# Altium schematic sheet BIO_SENSOR.SchDoc
size A3; SheetNumber: 7; SheetTotal: 12
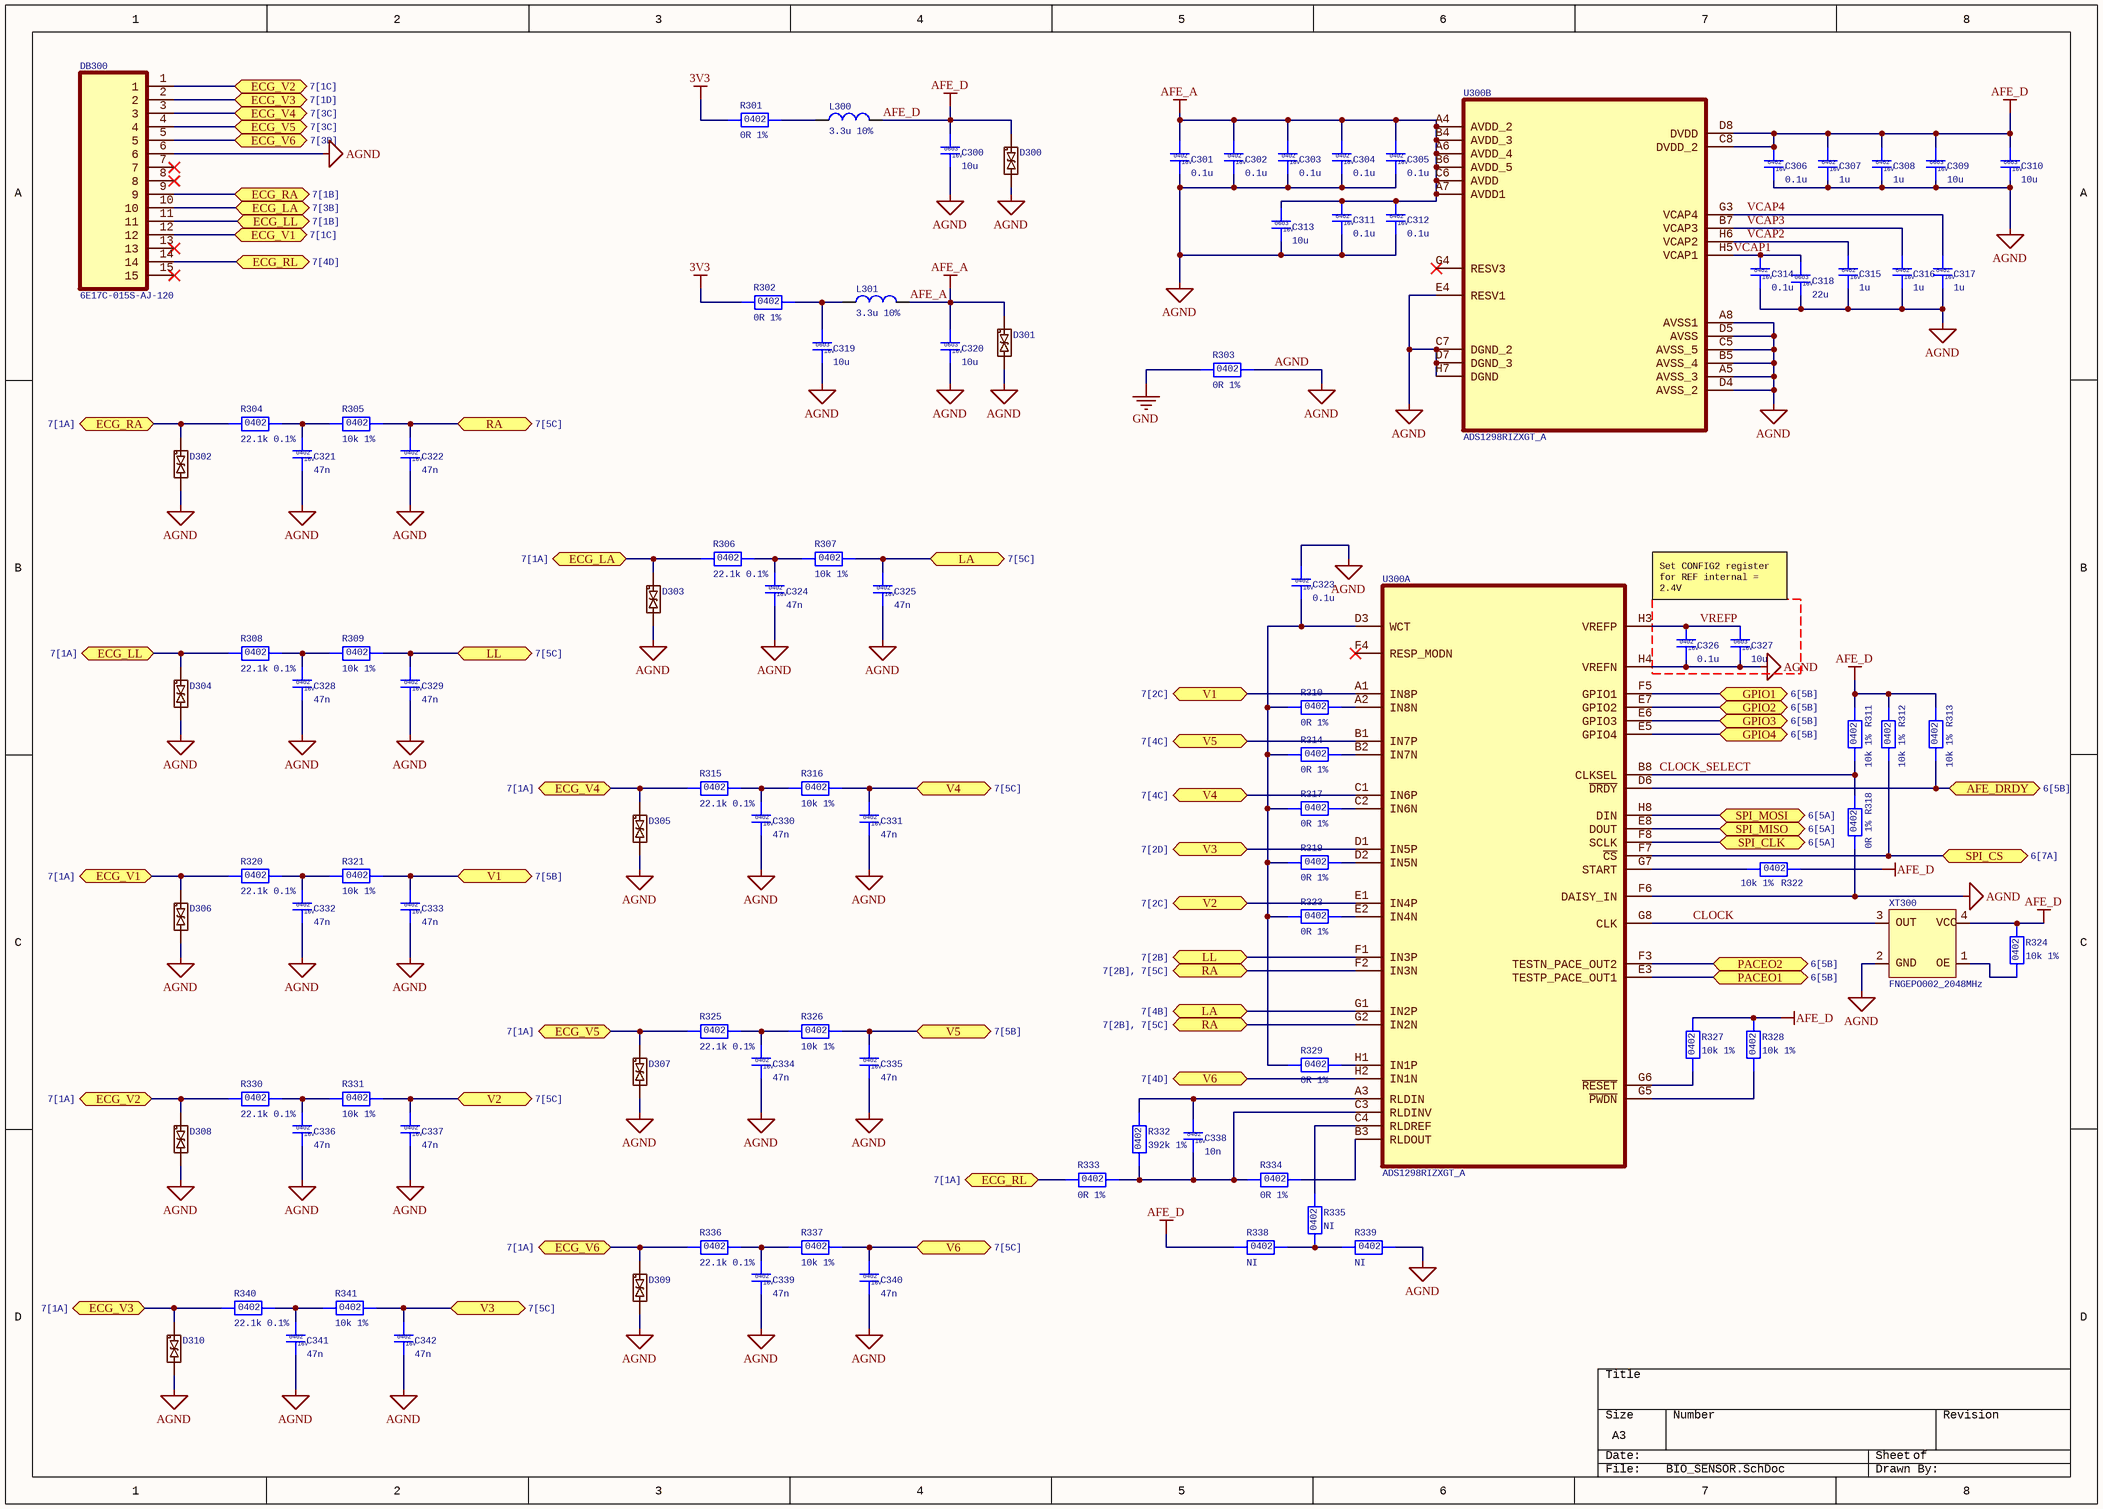
[diagram p0: BIO_SENSOR.SchDoc]

## Parts
C300  10u  [CAP0603]
C301  0.1u  [CAP0402]
C302  0.1u  [CAP0402]
C303  0.1u  [CAP0402]
C304  0.1u  [CAP0402]
C305  0.1u  [CAP0402]
C306  0.1u  [CAP0402]
C307  1u  [CAP0402]
C308  1u  [CAP0402]
C309  10u  [CAP0603]
C310  10u  [CAP0603]
C311  0.1u  [CAP0402]
C312  0.1u  [CAP0402]
C313  10u  [CAP0603]
C314  0.1u  [CAP0402]
C315  1u  [CAP0402]
C316  1u  [CAP0402]
C317  1u  [CAP0402]
C318  22u  [CAP0603]
C319  10u  [CAP0603]
C320  10u  [CAP0603]
C321  47n  [CAP0402]
C322  47n  [CAP0402]
C323  0.1u  [CAP0402]
C324  47n  [CAP0402]
C325  47n  [CAP0402]
C326  0.1u  [CAP0402]
C327  10u  [CAP0603]
C328  47n  [CAP0402]
C329  47n  [CAP0402]
C330  47n  [CAP0402]
C331  47n  [CAP0402]
C332  47n  [CAP0402]
C333  47n  [CAP0402]
C334  47n  [CAP0402]
C335  47n  [CAP0402]
C336  47n  [CAP0402]
C337  47n  [CAP0402]
C338  10n  [CAP0402]
C339  47n  [CAP0402]
C340  47n  [CAP0402]
C341  47n  [CAP0402]
C342  47n  [CAP0402]
D300  DESD3V3S1BL-7B  [DESD3V3S1BL-7B]  (value not drawn)
D301  DESD3V3S1BL-7B  [DESD3V3S1BL-7B]  (value not drawn)
D302  DESD3V3S1BL-7B  [DESD3V3S1BL-7B]  (value not drawn)
D303  DESD3V3S1BL-7B  [DESD3V3S1BL-7B]  (value not drawn)
D304  DESD3V3S1BL-7B  [DESD3V3S1BL-7B]  (value not drawn)
D305  DESD3V3S1BL-7B  [DESD3V3S1BL-7B]  (value not drawn)
D306  DESD3V3S1BL-7B  [DESD3V3S1BL-7B]  (value not drawn)
D307  DESD3V3S1BL-7B  [DESD3V3S1BL-7B]  (value not drawn)
D308  DESD3V3S1BL-7B  [DESD3V3S1BL-7B]  (value not drawn)
D309  DESD3V3S1BL-7B  [DESD3V3S1BL-7B]  (value not drawn)
D310  DESD3V3S1BL-7B  [DESD3V3S1BL-7B]  (value not drawn)
DB300  6E17C-015S-AJ-120  [6E17C-015S-AJ-120]
L300  3.3u 10%  [0402(1005)]
L301  3.3u 10%  [0402(1005)]
R301  0R 1%  [RES0402]
R302  0R 1%  [RES0402]
R303  0R 1%  [RES0402]
R304  22.1k 0.1%  [R0402]
R305  10k 1%  [R0402]
R306  22.1k 0.1%  [R0402]
R307  10k 1%  [R0402]
R308  22.1k 0.1%  [R0402]
R309  10k 1%  [R0402]
R310  0R 1%  [RES0402]
R311  10k 1%  [R0402]
R312  10k 1%  [R0402]
R313  10k 1%  [R0402]
R314  0R 1%  [RES0402]
R315  22.1k 0.1%  [R0402]
R316  10k 1%  [R0402]
R317  0R 1%  [RES0402]
R318  0R 1%  [RES0402]
R319  0R 1%  [RES0402]
R320  22.1k 0.1%  [R0402]
R321  10k 1%  [R0402]
R322  10k 1%  [R0402]
R323  0R 1%  [RES0402]
R324  10k 1%  [R0402]
R325  22.1k 0.1%  [R0402]
R326  10k 1%  [R0402]
R327  10k 1%  [R0402]
R328  10k 1%  [R0402]
R329  0R 1%  [RES0402]
R330  22.1k 0.1%  [R0402]
R331  10k 1%  [R0402]
R332  392k 1%  [R0402]
R333  0R 1%  [RES0402]
R334  0R 1%  [RES0402]
R335  NI  [RES0402]
R336  22.1k 0.1%  [R0402]
R337  10k 1%  [R0402]
R338  NI  [RES0402]
R339  NI  [RES0402]
R340  22.1k 0.1%  [R0402]
R341  10k 1%  [R0402]
U300  ADS1298RIZXGT_A  [ADS1298RIZXGT]  (parts A,B of 2)
XT300  FNGEPO002_2048MHz  [FNGEPO002]

## Ports
AFE_DRDY (bidir, see 6[5B]), ECG_LA (bidir, see 7[1A]), ECG_LA (bidir, see 7[3B]), ECG_LL (bidir, see 7[1A]), ECG_LL (bidir, see 7[1B]), ECG_RA (bidir, see 7[1A]), ECG_RA (bidir, see 7[1B]), ECG_RL (bidir, see 7[1A]), ECG_RL (bidir, see 7[4D]), ECG_V1 (bidir, see 7[1A]), ECG_V1 (bidir, see 7[1C]), ECG_V2 (bidir, see 7[1A]), ECG_V2 (bidir, see 7[1C]), ECG_V3 (bidir, see 7[1A]), ECG_V3 (bidir, see 7[1D]), ECG_V4 (bidir, see 7[1A]), ECG_V4 (bidir, see 7[3C]), ECG_V5 (bidir, see 7[1A]), ECG_V5 (bidir, see 7[3C]), ECG_V6 (bidir, see 7[1A]), ECG_V6 (bidir, see 7[3D]), GPIO1 (bidir, see 6[5B]), GPIO2 (bidir, see 6[5B]), GPIO3 (bidir, see 6[5B]), GPIO4 (bidir, see 6[5B]), LA (bidir, see 7[4B]), LA (bidir, see 7[5C]), LL (bidir, see 7[2B]), LL (bidir, see 7[5C]), PACEO1 (bidir, see 6[5B]), PACEO2 (bidir, see 6[5B]), RA (bidir, see 7[2B], 7[5C]), RA (bidir, see 7[5C]), SPI_CLK (bidir, see 6[5A]), SPI_CS (bidir, see 6[7A]), SPI_MISO (bidir, see 6[5A]), SPI_MOSI (bidir, see 6[5A]), V1 (bidir, see 7[2C]), V1 (bidir, see 7[5B]), V2 (bidir, see 7[2C]), V2 (bidir, see 7[5C]), V3 (bidir, see 7[2D]), V3 (bidir, see 7[5C]), V4 (bidir, see 7[4C]), V4 (bidir, see 7[5C]), V5 (bidir, see 7[4C]), V5 (bidir, see 7[5B]), V6 (bidir, see 7[4D]), V6 (bidir, see 7[5C])

## Nets
3V3: R301.1 R302.1
AFE_A: C301.1 C302.1 C303.1 C304.1 C305.1 C311.1 C312.1 C313.1 C320.1 D301.1 L301.2 U300.A4(AVDD_2) U300.A6(AVDD_4) U300.A7(AVDD1) U300.B4(AVDD_3) U300.B6(AVDD_5) U300.C6(AVDD)
AFE_D: C300.1 C306.1 C307.1 C308.1 C309.1 C310.1 D300.1 L300.2 R311.2 R312.2 R313.2 R322.2 R324.2 R327.2 R328.2 R338.1 U300.C8(DVDD_2) U300.D8(DVDD) XT300.4(VCC)
AGND: C300.2 C301.2 C302.2 C303.2 C304.2 C305.2 C306.2 C307.2 C308.2 C309.2 C310.2 C311.2 C312.2 C313.2 C314.2 C315.2 C316.2 C317.2 C318.2 C319.2 C320.2 C321.2 C322.2 C323.1 C324.2 C325.2 C326.2 C327.2 C328.2 C329.2 C330.2 C331.2 C332.2 C333.2 C334.2 C335.2 C336.2 C337.2 C339.2 C340.2 C341.2 C342.2 D300.2 D301.2 D302.2 D303.2 D304.2 D305.2 D306.2 D307.2 D308.2 D309.2 D310.2 DB300.6 R303.2 R318.1 R339.2 U300.A5(AVSS_3) U300.A8(AVSS1) U300.B5(AVSS_4) U300.C5(AVSS_5) U300.C7(DGND_2) U300.D4(AVSS_2) U300.D5(AVSS) U300.D7(DGND_3) U300.E4(RESV1) U300.F6(DAISY_IN) U300.H4(VREFN) U300.H7(DGND) XT300.2
GND: R303.1
AFE_DRDY: R313.1 U300.D6(~{DRDY}) ; port AFE_DRDY
CLOCK: U300.G8(CLK) XT300.3(OUT)
CLOCK_SELECT: R311.1 R318.2 U300.B8(CLKSEL)
ECG_LA: D303.1 DB300.10 R306.1 ; port ECG_LA
ECG_LL: D304.1 DB300.11 R308.1 ; port ECG_LL
ECG_RA: D302.1 DB300.9 R304.1 ; port ECG_RA
ECG_RL: DB300.14 R333.1 ; port ECG_RL
ECG_V1: D306.1 DB300.12 R320.1 ; port ECG_V1
ECG_V2: D308.1 DB300.1 R330.1 ; port ECG_V2
ECG_V3: D310.1 DB300.2 R340.1 ; port ECG_V3
ECG_V4: D305.1 DB300.3 R315.1 ; port ECG_V4
ECG_V5: D307.1 DB300.4 R325.1 ; port ECG_V5
ECG_V6: D309.1 DB300.5 R336.1 ; port ECG_V6
GPIO1: U300.F5(GPIO1) ; port GPIO1
GPIO2: U300.E7(GPIO2) ; port GPIO2
GPIO3: U300.E6(GPIO3) ; port GPIO3
GPIO4: U300.E5(GPIO4) ; port GPIO4
LA: C325.1 R307.2 U300.G1(IN2P) ; port LA
LL: C329.1 R309.2 U300.F1(IN3P) ; port LL
PACEO1: U300.E3(TESTP_PACE_OUT1) ; port PACEO1
PACEO2: U300.F3(TESTN_PACE_OUT2) ; port PACEO2
RA: C322.1 R305.2 U300.F2(IN3N) U300.G2(IN2N) ; port RA
SPI_CLK: U300.F8(SCLK) ; port SPI_CLK
SPI_CS: R312.1 U300.F7(~{CS}) ; port SPI_CS
SPI_MISO: U300.E8(DOUT) ; port SPI_MISO
SPI_MOSI: U300.H8(DIN) ; port SPI_MOSI
V1: C333.1 R321.2 U300.A1(IN8P) ; port V1
V2: C337.1 R331.2 U300.E1(IN4P) ; port V2
V3: C342.1 R341.2 U300.D1(IN5P) ; port V3
V4: C331.1 R316.2 U300.C1(IN6P) ; port V4
V5: C335.1 R326.2 U300.B1(IN7P) ; port V5
V6: C340.1 R337.2 U300.H2(IN1N) ; port V6
VCAP1: C314.1 C318.1 U300.H5(VCAP1)
VCAP2: C315.1 U300.H6(VCAP2)
VCAP3: C316.1 U300.B7(VCAP3)
VCAP4: C317.1 U300.G3(VCAP4)
VREFP: C326.1 C327.1 U300.H3(VREFP)
NetC319_1: C319.1 L301.1 R302.2
NetC321_1: C321.1 R304.2 R305.1
NetC323_2: C323.2 R310.1 R314.1 R317.1 R319.1 R323.1 R329.1 U300.D3(WCT)
NetC324_1: C324.1 R306.2 R307.1
NetC328_1: C328.1 R308.2 R309.1
NetC330_1: C330.1 R315.2 R316.1
NetC332_1: C332.1 R320.2 R321.1
NetC334_1: C334.1 R325.2 R326.1
NetC336_1: C336.1 R330.2 R331.1
NetC338_1: C338.1 R332.2 U300.A3(RLDIN)
NetC338_2: C338.2 R332.1 R333.2 R334.1 U300.C3(RLDINV)
NetC339_1: C339.1 R336.2 R337.1
NetC341_1: C341.1 R340.2 R341.1
NetL300_1: L300.1 R301.2
NetR310_2: R310.2 U300.A2(IN8N)
NetR314_2: R314.2 U300.B2(IN7N)
NetR317_2: R317.2 U300.C2(IN6N)
NetR319_2: R319.2 U300.D2(IN5N)
NetR322_1: R322.1 U300.G7(START)
NetR323_2: R323.2 U300.E2(IN4N)
NetR324_1: R324.1 XT300.1
NetR327_1: R327.1 U300.G6(~{RESET})
NetR328_1: R328.1 U300.G5(~{PWDN})
NetR329_2: R329.2 U300.H1(IN1P)
NetR334_2: R334.2 U300.B3(RLDOUT)
NetR335_1: R335.1 R338.2 R339.1
NetR335_2: R335.2 U300.C4(RLDREF)

Not connected (* = marked no-connect by the designer): DB300 7* 8* 13* 15*; U300 F4(RESP_MODN)* G4(RESV3)*

## Notes on the sheet
- Set CONFIG2 register for REF internal = 2.4V
- (in symbol FNGEPO002_2048MHz) GND; OE

## Library data of the parts
C300 C309 C310 C313 C319 C320 C327 = C_0402_10u: Ceramic Capacitor, Multilayer, Ceramic, 16V, 20% +Tol, 20% -Tol, X5R, 15% TC, 10uF, Surface Mount, 0603; Manufacturer: Murata; Manufacturer Part Number: GRT188R61C106ME13D; Multilayer: Yes; Reference Standard: AEC-Q200; Supplier: Digikey; Supplier Part Number: 490-12318-1-ND; RoHS: Yes; Category: Ceramic Capacitors; Stock: 232325; Pricing: 1=0.24, 10=0.158, 50=0.1162, 100=0.0947, 500=0.07476, 1000=0.06313 (USD); Mounting Technology: Surface Mount; Pins: 2; Dielectric Material: Ceramic; Package Shape: Rectangular; Case/Package: 0603; Terminal Finish: Nickel; Min Operating Temperature: -55°C; Max Operating Temperature: 85°C; JESD-609 Code: e3; Value: 10uF; Capacitor Type: Ceramic; Tolerance  (fill in as +-): 20%; Packaging: Tape and Reel; Tolerance (fill in as +-): 20%; Rated DC Voltage (URdc): 16V; Temperature Characteristics Code: X5R; Termination: Wraparound; Reach SVHC Compliant: Yes; RoHS Compliant: Yes; ComponentLink1URL: https://datasheet.ciiva.com:443/pdfs/VipMasterIC/IC/MURE/MURE-S-A0004410517/MURE-S-A0004413840-1.pdf?src-supplier=IHS+Markit; ComponentLink1Description: https://datasheet.ciiva.com:443/pdfs/VipMasterIC/IC/MURE/MURE-S-A0004410517/MURE-S-A0004413840-1.pdf?src-supplier=IHS+Markit; ComponentLink2URL: http://search.murata.co.jp/Ceramy/image/img/A01X/G101/ENG/GRT188R61C106ME13-01.pdf?src-supplier=Digikey; ComponentLink2Description: http://search.murata.co.jp/Ceramy/image/img/A01X/G101/ENG/GRT188R61C106ME13-01.pdf?src-supplier=Digikey
C301-C306 C311 C312 C314 C323 C326 = C_0402_0.1u: Ceramic Capacitor, Multilayer, Ceramic, 16V, 10% +Tol, 10% -Tol, X7R, 15% TC, 0.1uF, Surface Mount, 0402; Manufacturer: Murata; Manufacturer Part Number: GRM155R71C104KA88J; Value: 100nF; Multilayer: Yes; Supplier: Digikey; Supplier Part Number: 490-6328-1-ND; RoHS: Yes; Category: Ceramic Capacitors; Stock: 19409569; Pricing: 1=0.1, 10=0.019, 50=0.011, 100=0.0086, 500=0.00646, 1000=0.00508, 2500=0.00462, 5000=0.00425 (USD); Mounting Technology: Surface Mount; Pins: 2; Dielectric Material: Ceramic; Package Shape: Rectangular; Case/Package: 0402; Terminal Finish: Nickel; Min Operating Temperature: -55°C; Max Operating Temperature: 125°C; JESD-609 Code: e3; Capacitor Type: Ceramic; Tolerance  (fill in as +-): 10%; Package Style: SMTMeter; Packaging: Tape and Reel; Tolerance (fill in as +-): 10%; Rated DC Voltage (URdc): 16V; Temperature Characteristics Code: X7R; Termination: Wraparound; Length: 1mm; Width: 0.5mm; Height: 0.5mm; Reach SVHC Compliant: Yes; RoHS Compliant: Yes; ComponentLink1URL: https://psearch.en.murata.com:443/capacitor/product/GRM155R71C104KA88%23.pdf?src-supplier=IHS+Markit; ComponentLink1Description: https://psearch.en.murata.com:443/capacitor/product/GRM155R71C104KA88%23.pdf?src-supplier=IHS+Markit; ComponentLink2URL: https://datasheet.ciiva.com/6271/product-6271168.pdf?src-supplier=Digikey; ComponentLink2Description: https://datasheet.ciiva.com/6271/product-6271168.pdf?src-supplier=Digikey; ComponentLink3URL: https://datasheet.ciiva.com/6271/grm155r71c104ka88-01-6271231.pdf?src-supplier=Digikey; ComponentLink3Description: https://datasheet.ciiva.com/6271/grm155r71c104ka88-01-6271231.pdf?src-supplier=Digikey
C307 C308 C315-C317 = C_0402_1u: Ceramic Capacitor, Multilayer, Ceramic, 16V, 10% +Tol, 10% -Tol, X5R, 15% TC, 1uF, Surface Mount, 0402; Manufacturer: Taiyo Yuden; Manufacturer Part Number: EMK105BJ105KV-F; Multilayer: Yes; Supplier: Digikey; Supplier Part Number: 587-2477-1-ND; RoHS: Yes; Category: Ceramic Capacitors; Stock: 2709915; Pricing: 1=0.1, 10=0.045, 50=0.031, 100=0.0266, 500=0.01912, 1000=0.01682, 2500=0.01437, 5000=0.01289 (USD); Mounting Technology: Surface Mount; Pins: 2; Dielectric Material: Ceramic; Package Shape: Rectangular; Case/Package: 0402; Terminal Finish: Nickel; Min Operating Temperature: -55°C; Max Operating Temperature: 85°C; JESD-609 Code: e3; Value: 1uF; Capacitor Type: Ceramic; Tolerance  (fill in as +-): 10%; Package Style: SMTMeter; Packaging: Tape and Reel; Tolerance (fill in as +-): 10%; Rated DC Voltage (URdc): 16V; Temperature Characteristics Code: X5R; Termination: Wraparound; Length: 1mm; Width: 0.5mm; Height: 0.5mm; Reach SVHC Compliant: Yes; RoHS Compliant: Yes; ComponentLink1URL: https://datasheet.ciiva.com:443/pdfs/VipMasterIC/IC/TAIY/TAIY-S-A0009096450/TAIY-S-A0009096597-1.pdf?src-supplier=IHS+Markit; ComponentLink1Description: https://datasheet.ciiva.com:443/pdfs/VipMasterIC/IC/TAIY/TAIY-S-A0009096450/TAIY-S-A0009096597-1.pdf?src-supplier=IHS+Markit; ComponentLink2URL: https://datasheet.ciiva.com/134/emk105bj105kv-f-ss-134209.pdf?src-supplier=Digikey; ComponentLink2Description: https://datasheet.ciiva.com/134/emk105bj105kv-f-ss-134209.pdf?src-supplier=Digikey; ComponentLink3URL: https://datasheet.ciiva.com/15920/964emk105bj105kv-f-15920402.pdf?src-supplier=Onlinecomponents.com; ComponentLink3Description: https://datasheet.ciiva.com/15920/964emk105bj105kv-f-15920402.pdf?src-supplier=Onlinecomponents.com; ComponentLink4URL: https://datasheet.ciiva.com/26871/getdatasheetpartid-638287-26871289.pdf?src-supplier=Verical; ComponentLink4Description: https://datasheet.ciiva.com/26871/getdatasheetpartid-638287-26871289.pdf?src-supplier=Verical; ComponentLink5URL: https://datasheet.ciiva.com/30259/265emk105bj105kv-f-30259872.pdf?src-supplier=Onlinecomponents.com; ComponentLink5Description: https://datasheet.ciiva.com/30259/265emk105bj105kv-f-30259872.pdf?src-supplier=Onlinecomponents.com; ComponentLink6URL: https://datasheet.ciiva.com/7657/1497285-7657320.pdf?src-supplier=Element14; ComponentLink6Description: https://datasheet.ciiva.com/7657/1497285-7657320.pdf?src-supplier=Element14; ComponentLink7URL: https://datasheet.ciiva.com/22694/1497285-22694239.pdf?src-supplier=Element14; ComponentLink7Description: https://datasheet.ciiva.com/22694/1497285-22694239.pdf?src-supplier=Element14; ComponentLink8URL: https://datasheet.ciiva.com/5424/mlcc01-e-5424190.pdf?src-supplier=Mouser; ComponentLink8Description: https://datasheet.ciiva.com/5424/mlcc01-e-5424190.pdf?src-supplier=Mouser
C318 = C_0402_22u: Ceramic Capacitor, Multilayer, Ceramic, 16V, 20% +Tol, 20% -Tol, X5R, 15% TC, 22uF, Surface Mount, 0603; Manufacturer: Samsung; Manufacturer Part Number: CL10A226MO7JZNC; Multilayer: Yes; Supplier: Digikey; Supplier Part Number: 1276-7076-1-ND; RoHS: Yes; Category: Ceramic Capacitors; Stock: 1046811; Pricing: 1=0.59, 10=0.398, 50=0.3164, 100=0.2614, 500=0.20418, 1000=0.17355, 4000=0.15314, 8000=0.14293, 12000=0.14038, 28000=0.13782 (USD); Mounting Technology: Surface Mount; Pins: 2; Dielectric Material: Ceramic; Package Shape: Rectangular; Case/Package: 0603; Min Operating Temperature: -55°C; Max Operating Temperature: 85°C; Value: 22uF; Capacitor Type: Ceramic; Tolerance  (fill in as +-): 20%; Packaging: Tape and Reel; Tolerance (fill in as +-): 20%; Rated DC Voltage (URdc): 16V; Temperature Characteristics Code: X5R; Termination: Wraparound; Reach SVHC Compliant: Yes; RoHS Compliant: Yes; ComponentLink1URL: https://datasheet.ciiva.com:443/pdfs/VipMasterIC/IC/SEMS/SEMS-S-A0008524842/SEMS-S-A0008524715-1.pdf?src-supplier=IHS+Markit; ComponentLink1Description: https://datasheet.ciiva.com:443/pdfs/VipMasterIC/IC/SEMS/SEMS-S-A0008524842/SEMS-S-A0008524715-1.pdf?src-supplier=IHS+Markit; ComponentLink2URL: http://www.samsungsem.com/kr/support/product-search/mlcc/CL10A226MO7JZNC.jsp?src-supplier=Digikey; ComponentLink2Description: http://www.samsungsem.com/kr/support/product-search/mlcc/CL10A226MO7JZNC.jsp?src-supplier=Digikey; ComponentLink3URL: https://datasheet.octopart.com/CL10A226MO7JZNC-Samsung-Electro-Mechanics-datasheet-149156497.pdf?src-supplier=Future+Electronics; ComponentLink3Description: https://datasheet.octopart.com/CL10A226MO7JZNC-Samsung-Electro-Mechanics-datasheet-149156497.pdf?src-supplier=Future+Electronics
C321 C322 C324 C325 C328-C337 C339-C342 = C_0402_47n: Ceramic Capacitor, Multilayer, Ceramic, 16V, 10% +Tol, 10% -Tol, X7R, 15% TC, 0.047uF, Surface Mount, 0402; Manufacturer: Murata; Manufacturer Part Number: GCM155R71C473KA37D; Value: 47nF; Multilayer: Yes; Reference Standard: AEC-Q200; Supplier: Digikey; Supplier Part Number: 490-6042-1-ND; RoHS: Yes; Category: Ceramic Capacitors; Stock: 703056; Pricing: 1=0.1, 10=0.031, 50=0.018, 100=0.0139, 500=0.01046, 1000=0.00821, 2500=0.00747, 5000=0.00687 (USD); Mounting Technology: Surface Mount; Pins: 2; Dielectric Material: Ceramic; Package Shape: Rectangular; Case/Package: 0402; Terminal Finish: Nickel; Min Operating Temperature: -55°C; Max Operating Temperature: 125°C; JESD-609 Code: e3; Capacitor Type: Ceramic; Tolerance  (fill in as +-): 10%; Package Style: SMTMeter; Packaging: Tape and Reel; Tolerance (fill in as +-): 10%; Rated DC Voltage (URdc): 16V; Temperature Characteristics Code: X7R; Termination: Wraparound; Length: 1mm; Width: 0.5mm; Height: 0.55mm; Reach SVHC Compliant: Yes; RoHS Compliant: Yes; ComponentLink1URL: https://datasheet.ciiva.com:443/pdfs/VipMasterIC/IC/MURE/MURE-S-A0004370842/MURE-S-A0004373024-1.pdf?src-supplier=IHS+Markit; ComponentLink1Description: https://datasheet.ciiva.com:443/pdfs/VipMasterIC/IC/MURE/MURE-S-A0004370842/MURE-S-A0004373024-1.pdf?src-supplier=IHS+Markit; ComponentLink2URL: https://datasheet.ciiva.com/11607/product-11607786.pdf?src-supplier=Avnet; ComponentLink2Description: https://datasheet.ciiva.com/11607/product-11607786.pdf?src-supplier=Avnet; ComponentLink3URL: https://datasheet.ciiva.com/6270/s0717e-6270764.pdf?src-supplier=Digikey; ComponentLink3Description: https://datasheet.ciiva.com/6270/s0717e-6270764.pdf?src-supplier=Digikey; ComponentLink4URL: https://datasheet.ciiva.com/6270/s0717e-6270765.pdf?src-supplier=Digikey; ComponentLink4Description: https://datasheet.ciiva.com/6270/s0717e-6270765.pdf?src-supplier=Digikey; ComponentLink5URL: https://datasheet.ciiva.com/6270/s0717e-6270766.pdf?src-supplier=Digikey; ComponentLink5Description: https://datasheet.ciiva.com/6270/s0717e-6270766.pdf?src-supplier=Digikey
C338 = C_0402_10n: Ceramic Capacitor, Multilayer, Ceramic, 16V, 10% +Tol, 10% -Tol, X7R, 15% TC, 0.01uF, Surface Mount, 0402; Manufacturer: Murata; Manufacturer Part Number: GRM155R71C103KA01D; Value: 10nF; Multilayer: Yes; Supplier: Digikey; Supplier Part Number: 490-1313-1-ND; RoHS: Yes; Category: Ceramic Capacitors; Stock: 11195634; Pricing: 1=0.1, 10=0.019, 50=0.011, 100=0.0086, 500=0.00646, 1000=0.00508, 2500=0.00462, 5000=0.00425, 10000=0.00388, 20000=0.00369, 30000=0.00351, 50000=0.00325 (USD); Mounting Technology: Surface Mount; Pins: 2; Dielectric Material: Ceramic; Package Shape: Rectangular; Case/Package: 0402; Terminal Finish: Nickel; Min Operating Temperature: -55°C; Max Operating Temperature: 125°C; JESD-609 Code: e3; Capacitor Type: Ceramic; Tolerance  (fill in as +-): 10%; Package Style: SMTMeter; Packaging: Tape and Reel; Tolerance (fill in as +-): 10%; Rated DC Voltage (URdc): 16V; Temperature Characteristics Code: X7R; Termination: Wraparound; Length: 1mm; Width: 0.5mm; Height: 0.5mm; Reach SVHC Compliant: Yes; RoHS Compliant: Yes; ComponentLink1URL: https://datasheet.ciiva.com:443/pdfs/VipMasterIC/IC/MURE/MURE-S-A0008911298/MURE-S-A0008911430-1.pdf?src-supplier=IHS+Markit; ComponentLink1Description: https://datasheet.ciiva.com:443/pdfs/VipMasterIC/IC/MURE/MURE-S-A0008911298/MURE-S-A0008911430-1.pdf?src-supplier=IHS+Markit; ComponentLink2URL: https://datasheet.ciiva.com/129/partnumbering-e-01-129775.pdf?src-supplier=Digikey; ComponentLink2Description: https://datasheet.ciiva.com/129/partnumbering-e-01-129775.pdf?src-supplier=Digikey; ComponentLink3URL: https://datasheet.ciiva.com/129/partnumbering-e-01-129774.pdf?src-supplier=Digikey; ComponentLink3Description: https://datasheet.ciiva.com/129/partnumbering-e-01-129774.pdf?src-supplier=Digikey; ComponentLink4URL: https://datasheet.ciiva.com/129/product-129776.pdf?src-supplier=Digikey; ComponentLink4Description: https://datasheet.ciiva.com/129/product-129776.pdf?src-supplier=Digikey; ComponentLink5URL: https://datasheet.ciiva.com/18184/getdatasheetpartid-178863-18184649.pdf?src-supplier=Verical; ComponentLink5Description: https://datasheet.ciiva.com/18184/getdatasheetpartid-178863-18184649.pdf?src-supplier=Verical; ComponentLink6URL: https://datasheet.ciiva.com/7937/608985-7937614.pdf?src-supplier=Element14; ComponentLink6Description: https://datasheet.ciiva.com/7937/608985-7937614.pdf?src-supplier=Element14; ComponentLink7URL: https://datasheet.ciiva.com/22698/608985-22698415.pdf?src-supplier=Element14; ComponentLink7Description: https://datasheet.ciiva.com/22698/608985-22698415.pdf?src-supplier=Element14
D300-D310 = DESD3V3S1BL-7B: Trans Voltage Suppressor Diode, 35W, 3.3V V(RWM), Bidirectional, 1 Element, Silicon; Manufacturer: Diodes; Package Body Material: Plastic; Max Breakdown Voltage: 6.5V; Min Breakdown Voltage: 3.8V; Number of Elements: 1; Max Power Dissipation: 250mW; Supplier 1: Digikey; Supplier Part Number 1: DESD3V3S1BL-7BDICT-ND; Supplier: Digikey; Supplier Part Number: DESD3V3S1BL-7BDICT-ND; Manufacturer Part Number: DESD3V3S1BL-7B; RoHS: Yes; Category: TVS Diodes; Stock: 1369752; Pricing: 1=0.22, 10=0.148, 100=0.0722, 500=0.0602, 1000=0.04182, 2000=0.03625, 5000=0.03362, 10000=0.0302, 20000=0.02888 (USD); Pins: 2; Diode Element Material: SILICON; Package Shape: Rectangular; Terminal Finish: Nickel; Min Operating Temperature: -65°C; Max Operating Temperature: 150°C; JESD-609 Code: e4; Polarity: Bidirectional; Diode Type: TRANS VOLTAGE SUPPRESSOR; Moisture Sensitivity Level: 1; Non-rep Peak Rev Power Dis-Max: 35W; Package Style: CHIP CARRIERMeter; Rep Pk Reverse Voltage-Max: 3.3V; Surface Mount: Yes; Technology: AVALANCHE; Terminal Form: No Lead; Terminal Position: BOTTOM; Reach SVHC Compliant: Yes; RoHS Compliant: Yes; ComponentLink1URL: https://datasheet.ciiva.com:443/pdfs/VipMasterIC/IC/DIOD/DIOD-S-A0005045876/DIOD-S-A0005045876-1.pdf?src-supplier=IHS+Markit; ComponentLink1Description: https://datasheet.ciiva.com:443/pdfs/VipMasterIC/IC/DIOD/DIOD-S-A0005045876/DIOD-S-A0005045876-1.pdf?src-supplier=IHS+Markit; ComponentLink2URL: https://datasheet.ciiva.com/48480/desd3v3s1bl-48480026.pdf?src-supplier=Avnet; ComponentLink2Description: https://datasheet.ciiva.com/48480/desd3v3s1bl-48480026.pdf?src-supplier=Avnet
DB300 = 6E17C-015S-AJ-120: Conn D-Subminiature SKT 15 POS 2.74mm Solder RA Thru-Hole 15 Terminal 1 Port; Manufacturer: Amphenol Communications Solutions; Manufacturer Part Number: 6E17C015SAJ120; Supplier 1: Digikey; Supplier Part Number 1: 6E17C-015S-AJ-120-ND; Supplier: Digikey; Supplier Part Number: 6E17C-015S-AJ-120-ND; RoHS: No; Category: D-Sub Connectors; Stock: 1673; Pricing: 1=7.56, 10=6.839, 25=6.4604, 50=6.303, 100=5.9879, 250=5.35756, 450=5.0424, 950=4.41211 (USD)
L300 L301 = Inductor 3.3u: General Purpose Inductor, 2.7uH, 10%, 1 Element, Ferrite-Core, SMD, 0402; Manufacturer: Abracon; Manufacturer Part Number: AIML-0402-2R7K-T; Case/Size Code: 0402; DC Resistance (DCR): 2R; Inductor Application: RF INDUCTOR; Channels: 1; Quality Factor-Min (at L-nom): 20; Max Current Rating: 10mA; Self Resonant Frequency: 22MHz; Shape/Size Description: RECTANGULAR PACKAGE; Shielding: Shielded; Test Frequency: 10MHz; Supplier: Digikey; Supplier Part Number: 535-11586-1-ND; RoHS: Yes; Category: Fixed Inductors; Stock: 9960; Pricing: 1=0.1, 10=0.06, 25=0.054, 50=0.05, 100=0.0464, 250=0.04192, 500=0.03886, 1000=0.03601, 2500=0.03255 (USD); Pins: 2; Core Material: Ferrite; Terminal Finish: Nickel; Min Operating Temperature: -55°C; Max Operating Temperature: 125°C; Tolerance: 10%; JESD-609 Code: e3; Inductance-Nom (L): 2.7uH; Inductor Type: GENERAL PURPOSE INDUCTOR; Manufacturer Series: AIML-0402; Surface Mount: Yes; Terminal Placement: Dual Ended; Termination: Wraparound; Reach SVHC Compliant: Yes; RoHS Compliant: Yes; ComponentLink1URL: https://datasheet.ciiva.com:443/pdfs/VipMasterIC/IC/ABRC/ABRC-S-A0008586383/ABRC-S-A0008586383-1.pdf?src-supplier=IHS+Markit; ComponentLink1Description: https://datasheet.ciiva.com:443/pdfs/VipMasterIC/IC/ABRC/ABRC-S-A0008586383/ABRC-S-A0008586383-1.pdf?src-supplier=IHS+Markit; ComponentLink2URL: https://datasheet.ciiva.com/1053/aiml-0402-1053196.pdf?src-supplier=Digikey; ComponentLink2Description: https://datasheet.ciiva.com/1053/aiml-0402-1053196.pdf?src-supplier=Digikey; ComponentLink3URL: https://datasheet.ciiva.com/1053/aiml-0402-1053197.pdf?src-supplier=Digikey; ComponentLink3Description: https://datasheet.ciiva.com/1053/aiml-0402-1053197.pdf?src-supplier=Digikey; ComponentLink4URL: https://datasheet.ciiva.com/1053/aiml-0402-1053198.pdf?src-supplier=Digikey; ComponentLink4Description: https://datasheet.ciiva.com/1053/aiml-0402-1053198.pdf?src-supplier=Digikey
R301-R303 R310 R314 R317-R319 R323 R329 R333 R334 = R_0402_0R: Metal Glaze/thick Film, 0.0625W, 0ohm, Surface Mount, 0402; Manufacturer: Yageo; Manufacturer Part Number: RC0402JR-070RL; Power: 62.5mW; Rated Temperature: 70°C; Package Height: 0.35mm; Package Length: 1mm; Package Width: 0.5mm; Supplier 1: Digikey; Supplier Part Number 1: 311-0.0JRTR-ND; Supplier: Digikey; Supplier Part Number: 311-0.0JRCT-ND; RoHS: Yes; Category: Chip SMD Resistors; Stock: 14877447; Pricing: 1=0.1, 10=0.011, 25=0.0084, 50=0.0064, 100=0.0045, 250=0.00364, 500=0.0029, 1000=0.00214, 5000=0.00154, 10000=0.00133, 30000=0.00117, 50000=0.00107, 100000=0.00105 (USD); Mounting Technology: Surface Mount; Pins: 2; Package Shape: Rectangular; Case/Package: 0402; Terminal Finish: Nickel; Min Operating Temperature: -55°C; Max Operating Temperature: 155°C; JESD-609 Code: e3; Resistor Type: FIXED RESISTOR; Packaging: Tape and Reel; Value: 0R; Technology: METAL GLAZE/THICK FILM; Termination: Wraparound; Construction: Chip; Package Style: SMTMeter; Reach SVHC Compliant: Yes; RoHS Compliant: Yes; ComponentLink1URL: https://datasheet.ciiva.com:443/pdfs/VipMasterIC/IC/YAGO/YAGO-S-A0008145938/YAGO-S-A0008145938-1.pdf?src-supplier=IHS+Markit; ComponentLink1Description: https://datasheet.ciiva.com:443/pdfs/VipMasterIC/IC/YAGO/YAGO-S-A0008145938/YAGO-S-A0008145938-1.pdf?src-supplier=IHS+Markit; ComponentLink2URL: https://datasheet.ciiva.com/2452/pyu-rc0402-51-rohs-l-6-2452608.pdf?src-supplier=Digikey; ComponentLink2Description: https://datasheet.ciiva.com/2452/pyu-rc0402-51-rohs-l-6-2452608.pdf?src-supplier=Digikey; ComponentLink3URL: https://datasheet.ciiva.com/11808/0900766b80c66297-11808195.pdf?src-supplier=Rs; ComponentLink3Description: https://datasheet.ciiva.com/11808/0900766b80c66297-11808195.pdf?src-supplier=Rs; ComponentLink4URL: https://datasheet.ciiva.com/7983/1018594-7983535.pdf?src-supplier=Element14; ComponentLink4Description: https://datasheet.ciiva.com/7983/1018594-7983535.pdf?src-supplier=Element14; ComponentLink5URL: https://datasheet.ciiva.com/22747/1018594-22747515.pdf?src-supplier=Element14; ComponentLink5Description: https://datasheet.ciiva.com/22747/1018594-22747515.pdf?src-supplier=Element14; ComponentLink6URL: https://datasheet.ciiva.com/2452/pyu-r-int-thick-7-2452609.pdf?src-supplier=Digikey; ComponentLink6Description: https://datasheet.ciiva.com/2452/pyu-r-int-thick-7-2452609.pdf?src-supplier=Digikey; ComponentLink7URL: https://datasheet.ciiva.com/2452/pyu-r-int-thick-7-2452610.pdf?src-supplier=Digikey; ComponentLink7Description: https://datasheet.ciiva.com/2452/pyu-r-int-thick-7-2452610.pdf?src-supplier=Digikey; ComponentLink8URL: https://datasheet.ciiva.com/8896/pyu-rc0402-51-rohs-l-6-8896201.pdf?src-supplier=Avnet; ComponentLink8Description: https://datasheet.ciiva.com/8896/pyu-rc0402-51-rohs-l-6-8896201.pdf?src-supplier=Avnet
R304 R306 R308 R315 R320 R325 R330 R336 R340 = R_0402_22.1k: Fixed Resistor, Thin Film, 0.063W, 22100ohm, 50V, 0.1% +/-Tol, 25ppm/Cel, Surface Mount, 0402; Manufacturer: Vishay Dale; Manufacturer Part Number: TNPW040222K1BEED; Manufacturer Series: TNPW; Power: 63mW; Rated Temperature: 70°C; Value: 22.1kR; Temperature Coefficient: 25ppm/°C; Supplier: Digikey; Supplier Part Number: TNP22.1KDACT-ND; RoHS: Yes; Category: Chip SMD Resistors; Stock: 60436; Pricing: 1=0.38, 10=0.272, 50=0.2098, 100=0.1863, 500=0.1394, 1000=0.12239, 5000=0.10368 (USD); Mounting Technology: Surface Mount; Pins: 2; Package Shape: Rectangular; Case/Package: 0402; Terminal Finish: Tin; Min Operating Temperature: -55°C; Max Operating Temperature: 125°C; Tolerance: 0.1%; JESD-609 Code: e3; Resistor Type: FIXED RESISTOR; Packaging: Tape and Reel; Technology: THIN FILM; Termination: Wraparound; Working Voltage: 50V; Reach SVHC Compliant: Yes; RoHS Compliant: Yes; ComponentLink1URL: https://datasheet.ciiva.com:443/pdfs/VipMasterIC/IC/DALE/DALES05753/DALES05753-1.pdf?src-supplier=IHS+Markit; ComponentLink1Description: https://datasheet.ciiva.com:443/pdfs/VipMasterIC/IC/DALE/DALES05753/DALES05753-1.pdf?src-supplier=IHS+Markit; ComponentLink2URL: http://www.mouser.com/ds/2/427/tnpw_e3-64594.pdf?src-supplier=Mouser; ComponentLink2Description: http://www.mouser.com/ds/2/427/tnpw_e3-64594.pdf?src-supplier=Mouser; ComponentLink3URL: http://www.farnell.com/datasheets/2618479.pdf?src-supplier=Farnell; ComponentLink3Description: http://www.farnell.com/datasheets/2618479.pdf?src-supplier=Farnell; ComponentLink4URL: http://www.vishay.com/docs/28758/tnpw_e3.pdf?src-supplier=Digikey; ComponentLink4Description: http://www.vishay.com/docs/28758/tnpw_e3.pdf?src-supplier=Digikey; ComponentLink5URL: http://www.vishay.com/docs/49252/_dbr_smd_resistor_product_overview_vmn_sg2189_1705.pdf?src-supplier=Digikey; ComponentLink5Description: http://www.vishay.com/docs/49252/_dbr_smd_resistor_product_overview_vmn_sg2189_1705.pdf?src-supplier=Digikey; ComponentLink6URL: http://www.vishay.com/docs/28758/tnpw_e3.pdf?src-supplier=Avnet; ComponentLink6Description: http://www.vishay.com/docs/28758/tnpw_e3.pdf?src-supplier=Avnet; ComponentLink7URL: http://www.farnell.com/datasheets/2618479.pdf?src-supplier=Newark; ComponentLink7Description: http://www.farnell.com/datasheets/2618479.pdf?src-supplier=Newark; ComponentLink8URL: https://datasheet.octopart.com/TNPW040222K1BEED-Vishay-datasheet-112277797.pdf?src-supplier=Newark; ComponentLink8Description: https://datasheet.octopart.com/TNPW040222K1BEED-Vishay-datasheet-112277797.pdf?src-supplier=Newark
R305 R307 R309 R311-R313 R316 R321 R322 R324 R326-R328 R331 R337 R341 = R_0402_10k: Fixed Resistor, Metal Glaze/thick Film, 0.06W, 10000ohm, 50V, 1% +/-Tol, 100ppm/Cel, Surface Mount, 0402; Manufacturer: Samsung; Manufacturer Part Number: RC1005F103CS; Power: 60mW; Value: 10kR; Temperature Coefficient: 100ppm/°C; Package Height: 0.35mm; Package Length: 1mm; Package Width: 0.5mm; Supplier: Digikey; Supplier Part Number: 1276-3431-1-ND; RoHS: Yes; Category: Chip SMD Resistors; Stock: 14343795; Pricing: 1=0.1, 10=0.024, 50=0.0156, 100=0.0132, 500=0.00922, 1000=0.00803, 5000=0.00598, 10000=0.00533, 20000=0.00481, 30000=0.00458 (USD); Mounting Technology: Surface Mount; Pins: 2; Package Shape: Rectangular; Case/Package: 0402; Terminal Finish: Nickel; Min Operating Temperature: -55°C; Max Operating Temperature: 125°C; Tolerance: 1%; JESD-609 Code: e3; Resistor Type: FIXED RESISTOR; Construction: Chip; Package Style: SMTMeter; Packaging: Tape and Reel; Technology: METAL GLAZE/THICK FILM; Working Voltage: 50V; Reach SVHC Compliant: Yes; RoHS Compliant: Yes; ComponentLink1URL: https://datasheet.ciiva.com:443/pdfs/VipMasterIC/IC/SEMS/SEMS-S-A0001326806/SEMS-S-A0001326806-1.pdf?src-supplier=IHS+Markit; ComponentLink1Description: https://datasheet.ciiva.com:443/pdfs/VipMasterIC/IC/SEMS/SEMS-S-A0001326806/SEMS-S-A0001326806-1.pdf?src-supplier=IHS+Markit; ComponentLink2URL: https://datasheet.ciiva.com/15196/getdatasheetpartid-504789-15196214.pdf?src-supplier=Verical; ComponentLink2Description: https://datasheet.ciiva.com/15196/getdatasheetpartid-504789-15196214.pdf?src-supplier=Verical; ComponentLink3URL: https://datasheet.ciiva.com/16481/rcseries-16481007.pdf?src-supplier=Future+Electronics; ComponentLink3Description: https://datasheet.ciiva.com/16481/rcseries-16481007.pdf?src-supplier=Future+Electronics
R332 = R_0402_392k: Fixed Resistor, Metal Glaze/thick Film, 0.1W, 392000ohm, 75V, 1% +/-Tol, 100ppm/Cel, Surface Mount, 0402; Manufacturer: KOA Speer; Manufacturer Part Number: RK73H1ETTP3923F; Additional Feature: PRECISION; Power: 100mW; Rated Temperature: 70°C; Value: 392kR; Temperature Coefficient: 100ppm/°C; Working Voltage: 50V; Package Height: 0.35mm; Package Length: 1mm; Package Width: 0.5mm; Reference Standard: AEC-Q200; Supplier: Digikey; Supplier Part Number: 2019-RK73H1ETTP3923FCT-ND; RoHS: Yes; Category: Chip SMD Resistors; Stock: 5184; Pricing: 1=0.1, 10=0.023, 50=0.0138, 100=0.0115, 500=0.00768, 1000=0.00657, 5000=0.00476 (USD); Mounting Technology: Surface Mount; Pins: 2; Case/Package: 0402; Terminal Finish: Nickel; Min Operating Temperature: -55°C; Max Operating Temperature: 155°C; Tolerance: 1%; JESD-609 Code: e3; Resistor Type: FIXED RESISTOR; Construction: Rectangular; Package Style: SMTMeter; Packaging: Tape and Reel; Technology: METAL GLAZE/THICK FILM; Termination: Wraparound; Reach SVHC Compliant: Yes; RoHS Compliant: Yes; ComponentLink1URL: https://datasheet.ciiva.com:443/pdfs/VipMasterIC/IC/KOAS/KOAS-S-A0009586304/KOAS-S-A0009586304-1.pdf?src-supplier=IHS+Markit; ComponentLink1Description: https://datasheet.ciiva.com:443/pdfs/VipMasterIC/IC/KOAS/KOAS-S-A0009586304/KOAS-S-A0009586304-1.pdf?src-supplier=IHS+Markit; ComponentLink2URL: https://datasheet.ciiva.com/3882/39733851s9852373n5146-3882825.pdf?src-supplier=Arrow+Electronics; ComponentLink2Description: https://datasheet.ciiva.com/3882/39733851s9852373n5146-3882825.pdf?src-supplier=Arrow+Electronics; ComponentLink3URL: https://datasheet.ciiva.com/5553/rk73h-5553836.pdf?src-supplier=Mouser; ComponentLink3Description: https://datasheet.ciiva.com/5553/rk73h-5553836.pdf?src-supplier=Mouser
R335 R338 R339 = R_0402_0R: Metal Glaze/thick Film, 0.0625W, 0ohm, Surface Mount, 0402; Manufacturer: Yageo; Manufacturer Part Number: RC0402JR-070RL; Power: 62.5mW; Rated Temperature: 70°C; Value: 0R; Package Height: 0.35mm; Package Length: 1mm; Package Width: 0.5mm; Supplier 1: Digikey; Supplier Part Number 1: 311-0.0JRTR-ND; Supplier: Digikey; Supplier Part Number: 311-0.0JRCT-ND; RoHS: Yes; Category: Chip SMD Resistors; Stock: 14877447; Pricing: 1=0.1, 10=0.011, 25=0.0084, 50=0.0064, 100=0.0045, 250=0.00364, 500=0.0029, 1000=0.00214, 5000=0.00154, 10000=0.00133, 30000=0.00117, 50000=0.00107, 100000=0.00105 (USD); Mounting Technology: Surface Mount; Pins: 2; Package Shape: Rectangular; Case/Package: 0402; Terminal Finish: Nickel; Min Operating Temperature: -55°C; Max Operating Temperature: 155°C; JESD-609 Code: e3; Resistor Type: FIXED RESISTOR; Packaging: Tape and Reel; Technology: METAL GLAZE/THICK FILM; Termination: Wraparound; Construction: Chip; Package Style: SMTMeter; Reach SVHC Compliant: Yes; RoHS Compliant: Yes; ComponentLink1URL: https://datasheet.ciiva.com:443/pdfs/VipMasterIC/IC/YAGO/YAGO-S-A0008145938/YAGO-S-A0008145938-1.pdf?src-supplier=IHS+Markit; ComponentLink1Description: https://datasheet.ciiva.com:443/pdfs/VipMasterIC/IC/YAGO/YAGO-S-A0008145938/YAGO-S-A0008145938-1.pdf?src-supplier=IHS+Markit; ComponentLink2URL: https://datasheet.ciiva.com/2452/pyu-rc0402-51-rohs-l-6-2452608.pdf?src-supplier=Digikey; ComponentLink2Description: https://datasheet.ciiva.com/2452/pyu-rc0402-51-rohs-l-6-2452608.pdf?src-supplier=Digikey; ComponentLink3URL: https://datasheet.ciiva.com/11808/0900766b80c66297-11808195.pdf?src-supplier=Rs; ComponentLink3Description: https://datasheet.ciiva.com/11808/0900766b80c66297-11808195.pdf?src-supplier=Rs; ComponentLink4URL: https://datasheet.ciiva.com/7983/1018594-7983535.pdf?src-supplier=Element14; ComponentLink4Description: https://datasheet.ciiva.com/7983/1018594-7983535.pdf?src-supplier=Element14; ComponentLink5URL: https://datasheet.ciiva.com/22747/1018594-22747515.pdf?src-supplier=Element14; ComponentLink5Description: https://datasheet.ciiva.com/22747/1018594-22747515.pdf?src-supplier=Element14; ComponentLink6URL: https://datasheet.ciiva.com/2452/pyu-r-int-thick-7-2452609.pdf?src-supplier=Digikey; ComponentLink6Description: https://datasheet.ciiva.com/2452/pyu-r-int-thick-7-2452609.pdf?src-supplier=Digikey; ComponentLink7URL: https://datasheet.ciiva.com/2452/pyu-r-int-thick-7-2452610.pdf?src-supplier=Digikey; ComponentLink7Description: https://datasheet.ciiva.com/2452/pyu-r-int-thick-7-2452610.pdf?src-supplier=Digikey; ComponentLink8URL: https://datasheet.ciiva.com/8896/pyu-rc0402-51-rohs-l-6-8896201.pdf?src-supplier=Avnet; ComponentLink8Description: https://datasheet.ciiva.com/8896/pyu-rc0402-51-rohs-l-6-8896201.pdf?src-supplier=Avnet
U300 = ADS1298RIZXGT_A: Analog Circuit, 1 Func, 8 Channel, PBGA64; Manufacturer: Texas Instruments; Package Body Material: Plastic; Channels: 1; Max Supply Voltage: 5.25V; Min Supply Voltage: 2.7V; Nominal Supply Voltage: 3V; Qualification Status: Not Qualified; Supplier 1: Digikey; Supplier Part Number 1: 4823-NRF5340-CLAA-RCT-ND; Supplier: Digikey; Supplier Part Number: 296-28273-1-ND; Manufacturer Part Number: ADS1298RIZXGT; RoHS: Yes; Category: Analog to Digital Converters (ADCs); Stock: 126; Pricing: 1=44.11, 10=33.755, 25=31.1068, 100=28.1554 (USD); Case/Package: LFBGA; Pins: 64; Package Shape: Square; Terminal Finish: Copper; Min Operating Temperature: -40°C; Max Operating Temperature: 85°C; JESD-609 Code: e1; Throw Configuration: ANALOG CIRCUIT; Moisture Sensitivity Level: 3; Package Style: GRID ARRAY, LOW PROFILE, FINE PITCHMeter; Peak Reflow Temperature (Cel): 260°C; Surface Mount: Yes; Terminal Form: Ball; Terminal Position: BOTTOM; Length: 8mm; Width: 8mm; Height - Seated (Max): 1.45mm; Terminal Pitch: 0.8mm; Temperature Grade: INDUSTRIAL; Reach SVHC Compliant: Yes; RoHS Compliant: Yes; ComponentLink1URL: https://www.ti.com:443/lit/ds/symlink/ads1294.pdf?src-supplier=IHS+Markit; ComponentLink1Description: https://www.ti.com:443/lit/ds/symlink/ads1294.pdf?src-supplier=IHS+Markit; ComponentLink2URL: https://datasheet.ciiva.com/1254/ads1294r-1254022.pdf?src-supplier=Digikey; ComponentLink2Description: https://datasheet.ciiva.com/1254/ads1294r-1254022.pdf?src-supplier=Digikey; ComponentLink3URL: https://datasheet.ciiva.com/1254/ads1294r-1254023.pdf?src-supplier=Digikey; ComponentLink3Description: https://datasheet.ciiva.com/1254/ads1294r-1254023.pdf?src-supplier=Digikey; ComponentLink4URL: https://datasheet.ciiva.com/1254/ads1294r-1254024.pdf?src-supplier=Digikey; ComponentLink4Description: https://datasheet.ciiva.com/1254/ads1294r-1254024.pdf?src-supplier=Digikey; ComponentLink5URL: https://datasheet.ciiva.com/5777/ads1296-5777151.pdf?src-supplier=Farnell; ComponentLink5Description: https://datasheet.ciiva.com/5777/ads1296-5777151.pdf?src-supplier=Farnell; ComponentLink6URL: https://datasheet.ciiva.com/7988/1796012-7988957.pdf?src-supplier=Element14; ComponentLink6Description: https://datasheet.ciiva.com/7988/1796012-7988957.pdf?src-supplier=Element14; ComponentLink7URL: https://datasheet.ciiva.com/15151/getdatasheetpartid-324164-15151959.pdf?src-supplier=Verical; ComponentLink7Description: https://datasheet.ciiva.com/15151/getdatasheetpartid-324164-15151959.pdf?src-supplier=Verical
XT300 = FNGEPO002_2048MHz: CMOS Output Clock Oscillator, 2.048MHz Nom; Manufacturer: Diodes; Package Body Material: Ceramic; Fall Time-Max: 7ns; Frequency Adjustment-Mechanical: No; Frequency Stability: 50%; Operating Frequency-Nom: 2.048; Output Load: 15pF; Power Supplies: 3.3V; Rise Time-Max: 7ms; Max Supply Current: 15mA; Symmetry-Max: 55/45%; Package Equivalence Code: DILCC4,.2,200; Max Supply Voltage: 3.63V; Min Supply Voltage: 2.97V; Qualification Status: Not Qualified; Supplier 1: Arrow Electronics; Supplier Part Number 1: FNGEPO002; Supplier: Digikey; Supplier Part Number: FNGEPO002CT-ND; Manufacturer Part Number: FNGEPO002; RoHS: Yes; Category: Oscillators; Stock: 1792; Pricing: 1=1.17, 10=1.114, 50=1.088, 100=0.9326, 500=0.90672 (USD); Mounting Technology: Surface Mount; Pins: 4; Terminal Finish: Gold; Min Operating Temperature: -20°C; Max Operating Temperature: 70°C; JESD-609 Code: e4; Oscillator Type: CMOS; Nominal Supply Voltage: 3.3V; Manufacturer Series: FNGEPO002; Reach SVHC Compliant: Yes; RoHS Compliant: Yes; ComponentLink1URL: https://datasheet.ciiva.com:443/pdfs/VipMasterIC/IC/PERI/PERIS03856/PERIS03856-1.pdf?src-supplier=IHS+Markit; ComponentLink1Description: https://datasheet.ciiva.com:443/pdfs/VipMasterIC/IC/PERI/PERIS03856/PERIS03856-1.pdf?src-supplier=IHS+Markit; ComponentLink2URL: https://datasheet.ciiva.com/868/fngepo002-868273.pdf?src-supplier=Digikey; ComponentLink2Description: https://datasheet.ciiva.com/868/fngepo002-868273.pdf?src-supplier=Digikey; ComponentLink3URL: https://datasheet.ciiva.com/16439/fngepo002-rev-f-16439191.pdf?src-supplier=Future+Electronics; ComponentLink3Description: https://datasheet.ciiva.com/16439/fngepo002-rev-f-16439191.pdf?src-supplier=Future+Electronics; ComponentLink4URL: https://datasheet.ciiva.com/868/fngepo002-868274.pdf?src-supplier=Digikey; ComponentLink4Description: https://datasheet.ciiva.com/868/fngepo002-868274.pdf?src-supplier=Digikey; ComponentLink5URL: https://datasheet.ciiva.com/868/fngepo002-868275.pdf?src-supplier=Digikey; ComponentLink5Description: https://datasheet.ciiva.com/868/fngepo002-868275.pdf?src-supplier=Digikey